# Altium schematic sheet Charger+Main_Power.SchDoc
size 420 x 297 mm
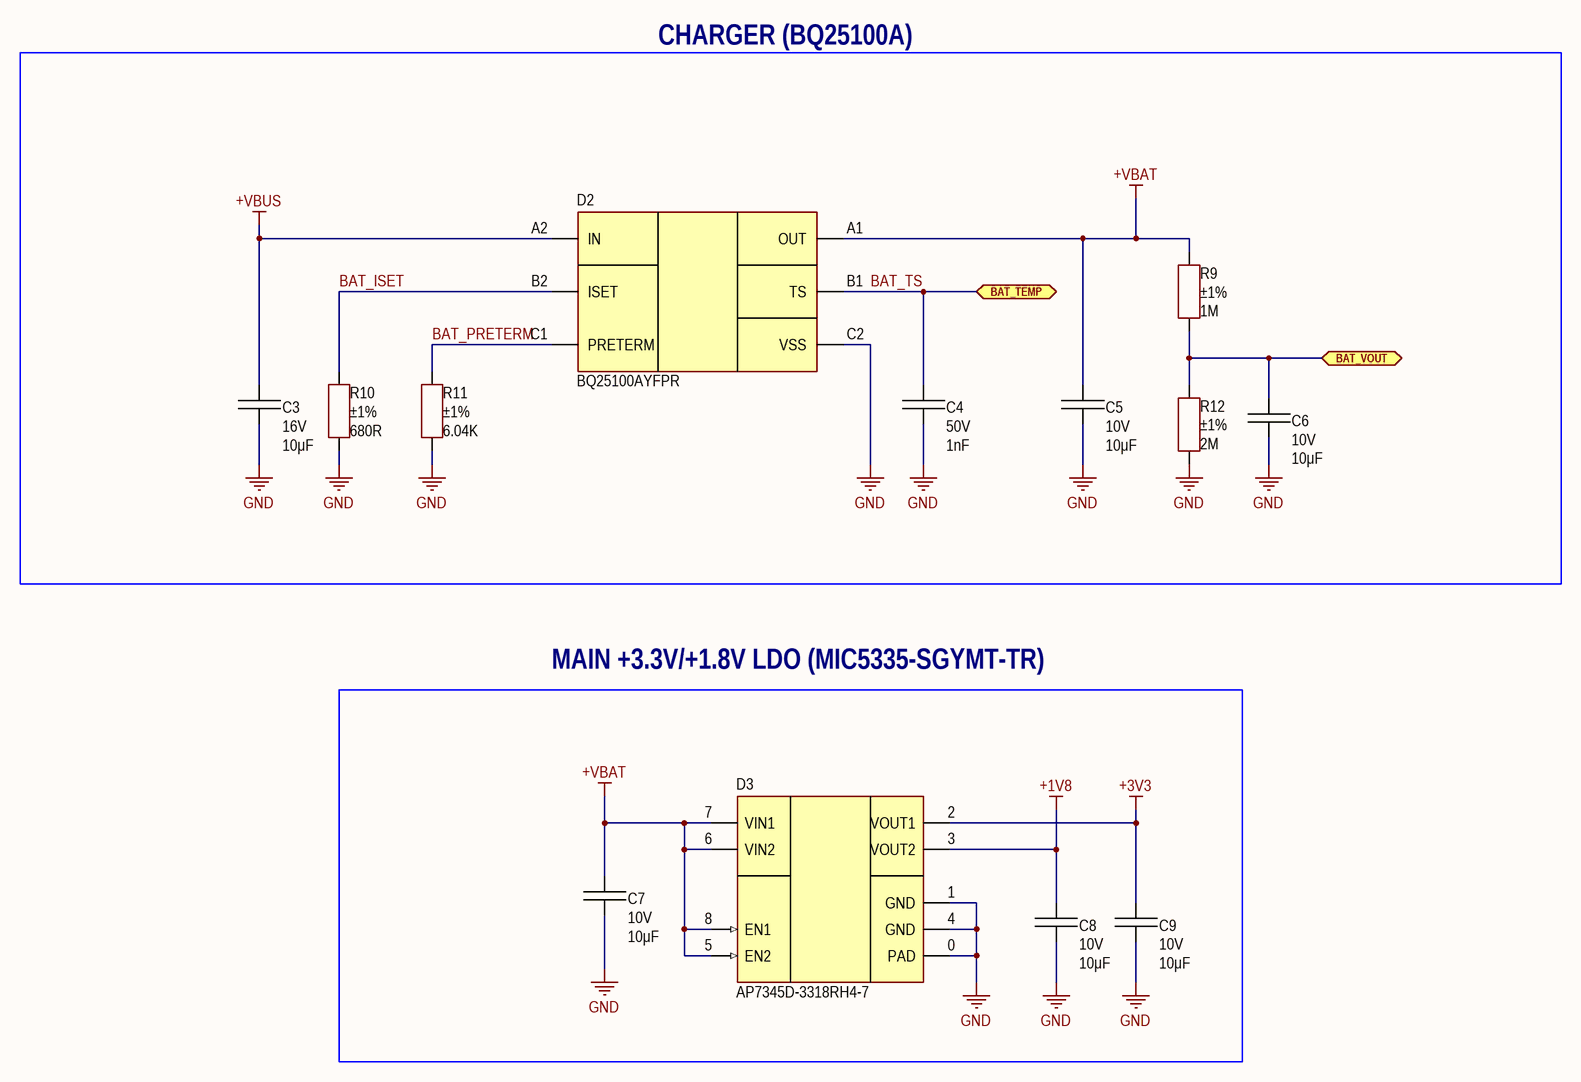
[diagram p0: Charger+Main_Power.SchDoc]

## Parts
C3  value 10μF  Voltage: 16V  [CAP: 0805]
C4  value 1nF  Voltage: 50V  [CAP: 0805]
C5  value 10μF  Voltage: 10V  [CAP: 0805]
C6  value 10μF  Voltage: 10V  [CAP: 0805]
C7  value 10μF  Voltage: 10V  [CAP: 0805]
C8  value 10μF  Voltage: 10V  [CAP: 0805]
C9  value 10μF  Voltage: 10V  [CAP: 0805]
D2  (no value)  [IC: BQ25100]
D3  (no value)  [IC: 8-XFDFN]
R9  value 1M  Tolerance: ±1%  [RES: 0805]
R10  value 680R  Tolerance: ±1%  [RES: 0805]
R11  value 6.04K  Tolerance: ±1%  [RES: 0805]
R12  value 2M  Tolerance: ±1%  [RES: 0805]

## Blocks framed on the sheet
CHARGER (BQ25100A): C3-C6 D2 R9-R12
MAIN +3.3V/+1.8V LDO (MIC5335-SGYMT-TR): C7-C9 D3

## Ports
BAT_TEMP (bidir), BAT_VOUT (bidir)

## Nets
+1V8: C8.2 D3.3(VOUT2)
+3V3: C9.2 D3.2(VOUT1)
+VBAT: C5.2 C7.2 D2.A1(OUT) D3.5(EN2) D3.6(VIN2) D3.7(VIN1) D3.8(EN1) R9.1
+VBUS: C3.2 D2.A2(IN)
GND: C3.1 C4.1 C5.1 C6.1 C7.1 C8.1 C9.1 D2.C2(VSS) D3.0(PAD) D3.1(GND) D3.4(GND) R10.2 R11.2 R12.2
BAT_ISET: D2.B2(ISET) R10.1
BAT_PRETERM: D2.C1(PRETERM) R11.1
BAT_TS: C4.2 D2.B1(TS) ; port BAT_TEMP
BAT_VOUT: C6.2 R9.2 R12.1 ; port BAT_VOUT

## Notes on the sheet
- Author
- Manufacturer
- Date
- Page
- Total pages
- Size page
- A3
- Materials

## Library data of the parts
C3 = Ceramic_0805: 10 µF ±20% 16V Ceramic Capacitor X7R 0805 (2012 Metric); Manufacturer: Yageo; PartNumber: CC0805MKX7R7BB106; ValueManufacturerPartNumber: Ceramic capacitor, 10μF, X7R, ±10%, 16V, 0805, -55...+125°C; Tolerance: ±10%; Package: 0805; HelpURL: https://www.digikey.com/en/products/detail/yageo/CC0805MKX7R7BB106/7164392; Temperature: -55...+125°C; TypeCapacitor: Ceramic capacitor; TypeDielectric: X7R
C4 = Ceramic_0805: 1000 pF ±5% 50V Ceramic Capacitor C0G, NP0 0805 (2012 Metric); Manufacturer: Yageo; PartNumber: CC0805JRNPO9BN102; ValueManufacturerPartNumber: Ceramic capacitor, 1nF, NP0, ±5%, 50V, 0805, -55...+125°C; Package: 0805; HelpURL: https://www.digikey.com/en/products/detail/yageo/CC0805JRNPO9BN102/302856; Temperature: -55...+125°C; TypeCapacitor: Ceramic capacitor; Tolerance: ±5%; TypeDielectric: NP0
C5-C9 = Ceramic_0805: 10 µF ±10% 10V Ceramic Capacitor X7R 0805 (2012 Metric); Manufacturer: Yageo; PartNumber: CC0805KFX7R6BB106; ValueManufacturerPartNumber: Ceramic capacitor, 10μF, X7R, ±10%, 10V, 0805, -55...+125°C; Package: 0805; HelpURL: https://www.digikey.com/en/products/detail/yageo/CC0805KFX7R6BB106/11611326; Temperature: -55...+125°C; TypeCapacitor: Ceramic capacitor; Tolerance: ±10%; TypeDielectric: X7R
D2 = BQ25100AYFPR: PMIC; Manufacturer: Texas Instruments; ValueManufacturerPartNumber: PMIC, Li-Ion/Li-Po, 4.45...6.45V, -40...+85°C, 10-WSON; Supply: 4.45...6.45V; HelpURL: https://www.digikey.com/en/products/detail/texas-instruments/BQ25100AYFPR/4977096; Package: 10-WSON; ComponentType: PMIC; Temperature: -40...+85°C; Standard: Li-Ion/Li-Po; PartNumber: BQ25100AYFPR
D3 = AP7345D-3318RH4-7: Linear voltage regulator; Manufacturer: Diodes Incorporated; ValueManufacturerPartNumber: Linear voltage regulator, input 3.6...5.25V, 0.39V, 3.3V/1.8V, 0.3A, -40...+125°C, 8-XFDFN; VoltageInput: input 3.6...5.25V; MaxDropout: 0.39V; CurrentOutput: 0.3A; VoltageOutput: 3.3V/1.8V; HelpURL: https://www.digikey.com/en/products/detail/diodes-incorporated/AP7345D-3318RH4-7/9857637; Package: 8-XFDFN; ComponentType: Linear voltage regulator; Temperature: -40...+125°C; PartNumber: AP7345D-3318RH4-7
R9 = Resistor_0805: 1 MOhms ±1% 0.125W, 1/8W Chip Resistor 0805 (2012 Metric) Moisture Resistant Thick Film; Manufacturer: Yageo; PartNumber: RC0805FR-071ML; ValueManufacturerPartNumber: Resistor film, 1M, ±1%, 0805, 0.125W, -55...+125°C; TypeResistor: Resistor film; Package: 0805; HelpURL: https://www.digikey.com/en/products/detail/yageo/RC0805FR-071ML/727445; Temperature: -55...+125°C; Power: 0.125W
R10 = Resistor_0805: 680 Ohms ±1% 0.125W, 1/8W Chip Resistor 0805 (2012 Metric) Moisture Resistant Thick Film; Manufacturer: Yageo; PartNumber: RC0805FR-07680RL; ValueManufacturerPartNumber: Resistor film, 680R, ±1%, 0805, 0.125W, -55...+125°C; TypeResistor: Resistor film; Package: 0805; HelpURL: https://www.digikey.com/en/products/detail/yageo/RC0805FR-07680RL/728101; Temperature: -55...+125°C; Power: 0.125W
R11 = Resistor_0805: 6.04 kOhms ±1% 0.125W, 1/8W Chip Resistor 0805 (2012 Metric) Moisture Resistant Thick Film; Manufacturer: Yageo; PartNumber: RC0805FR-076K04L; ValueManufacturerPartNumber: Resistor film, 6.04K, ±1%, 0805, 0.125W, -55...+125°C; TypeResistor: Resistor film; Package: 0805; HelpURL: https://www.digikey.com/en/products/detail/yageo/RC0805FR-076K04L/728049; Temperature: -55...+125°C; Power: 0.125W
R12 = Resistor_0805: 2 MOhms ±1% 0.125W, 1/8W Chip Resistor 0805 (2012 Metric) Moisture Resistant Thick Film; Manufacturer: Yageo; PartNumber: RC0805FR-072ML; ValueManufacturerPartNumber: Resistor film, 2M, ±1%, 0805, 0.125W, -55...+125°C; TypeResistor: Resistor film; Package: 0805; HelpURL: https://www.digikey.com/en/products/detail/yageo/RC0805FR-072ML/727665; Temperature: -55...+125°C; Power: 0.125W